# Altium schematic sheet Resistor - 316-379.SchDoc
size A0; SheetNumber: 8; SheetTotal: 41
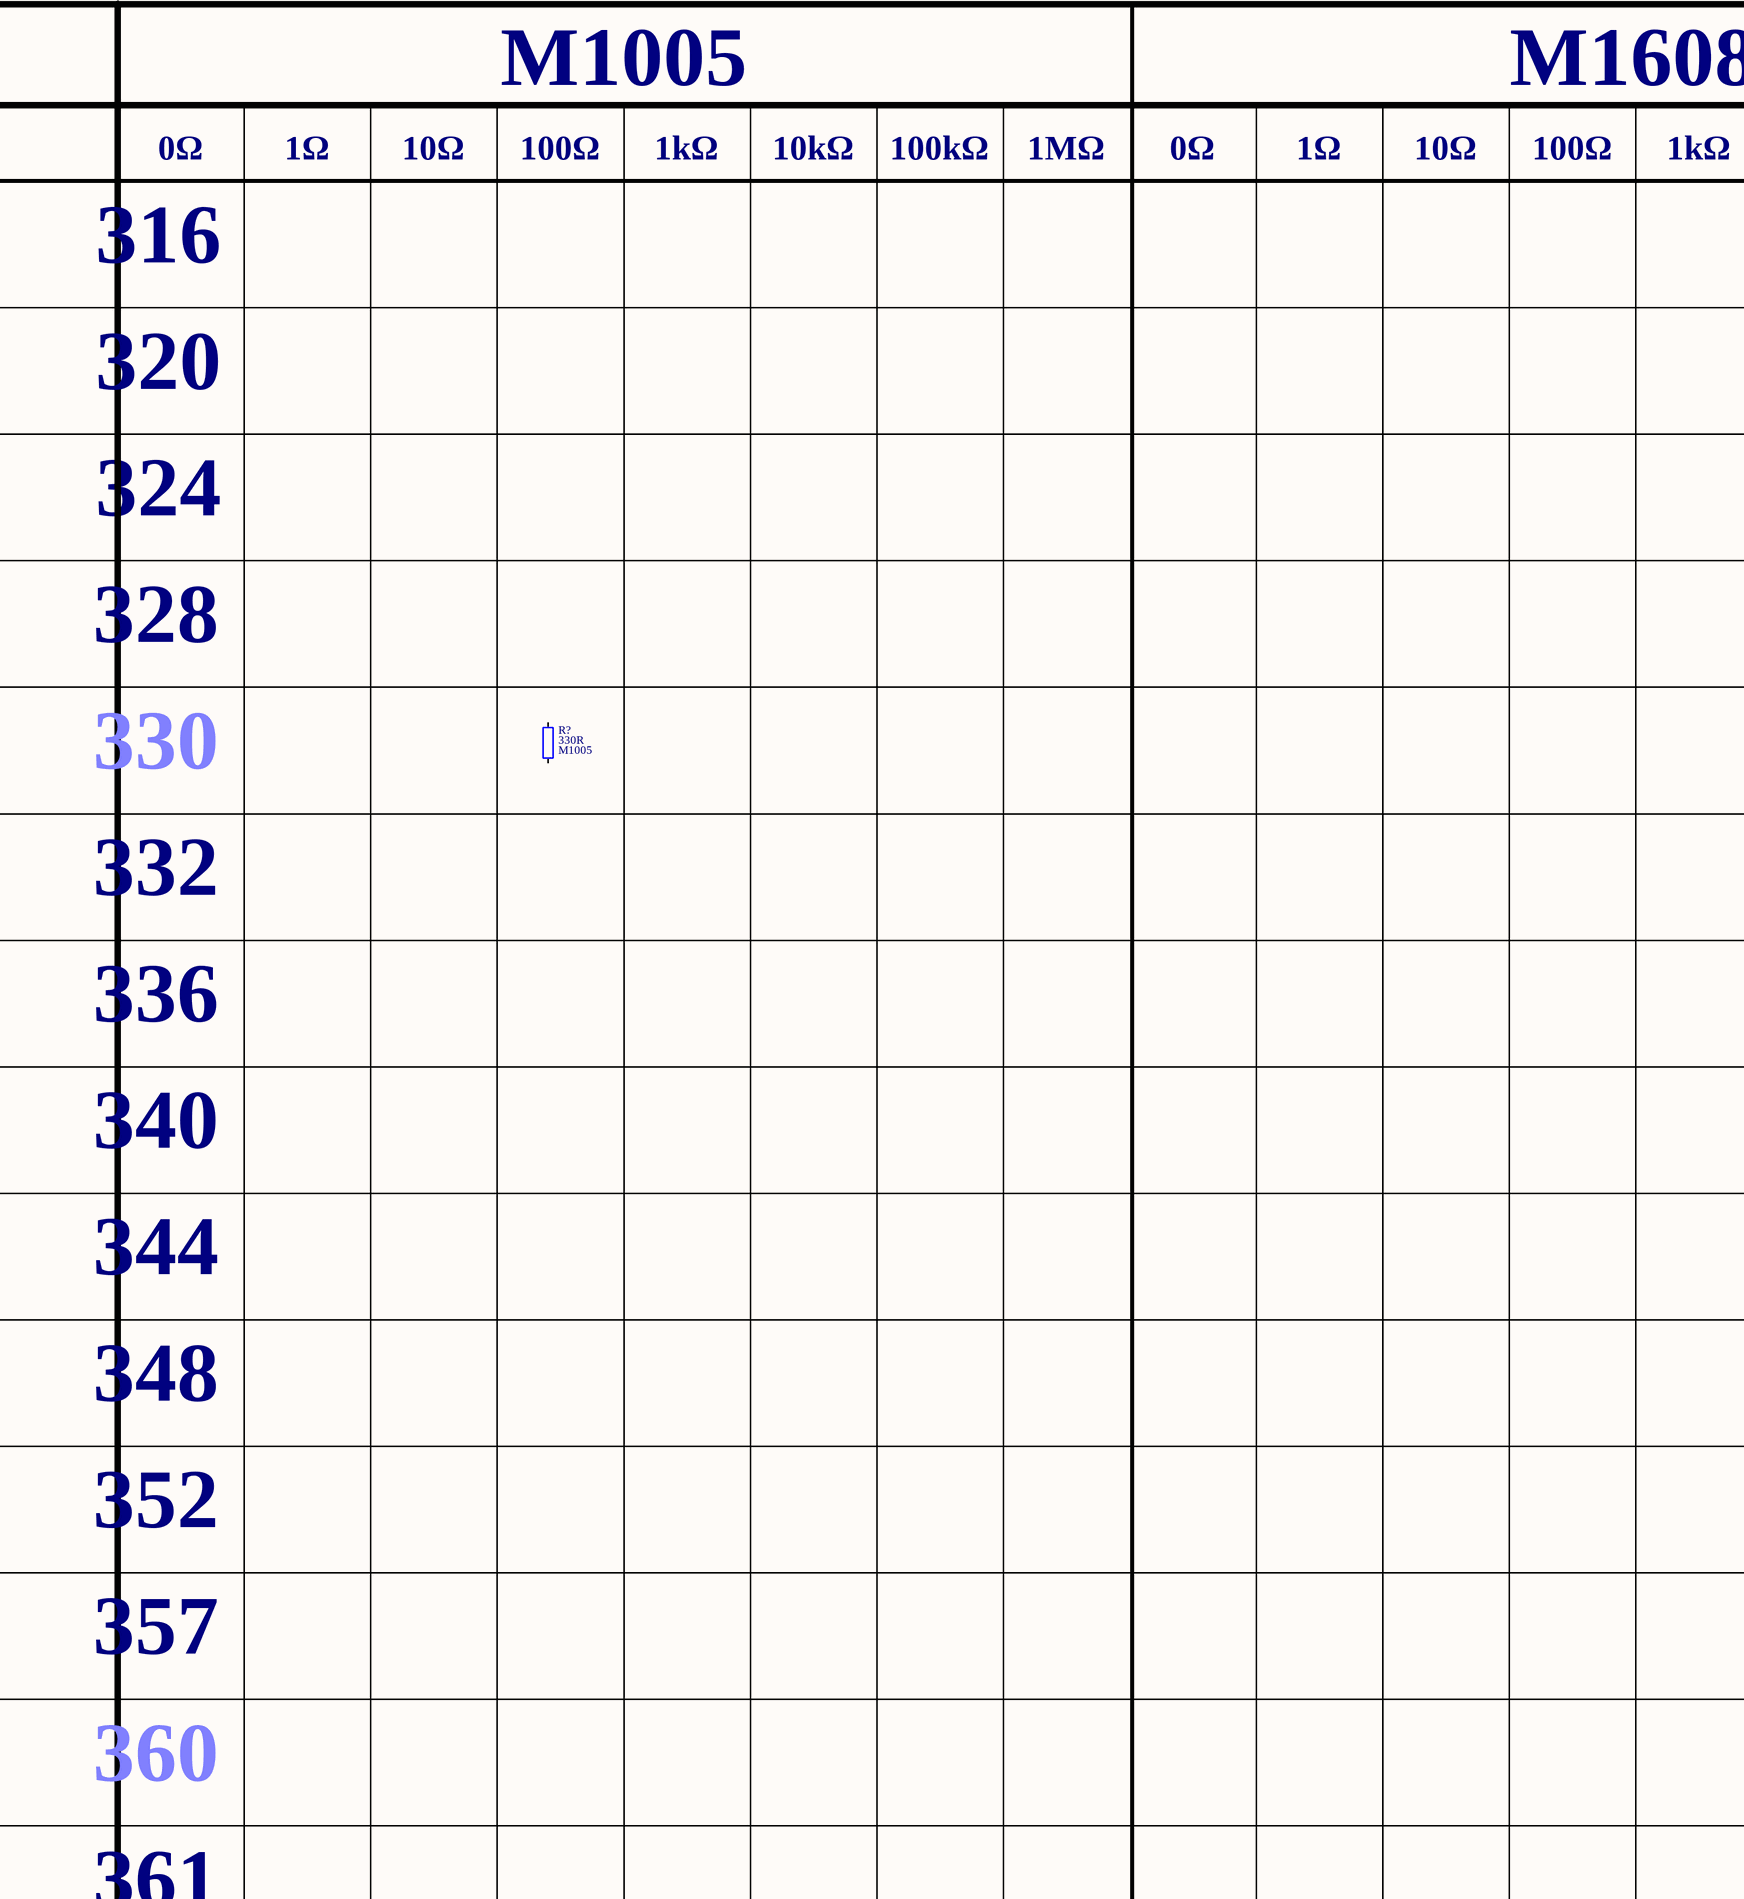
[diagram p0: Resistor - 316-379.SchDoc, top left]
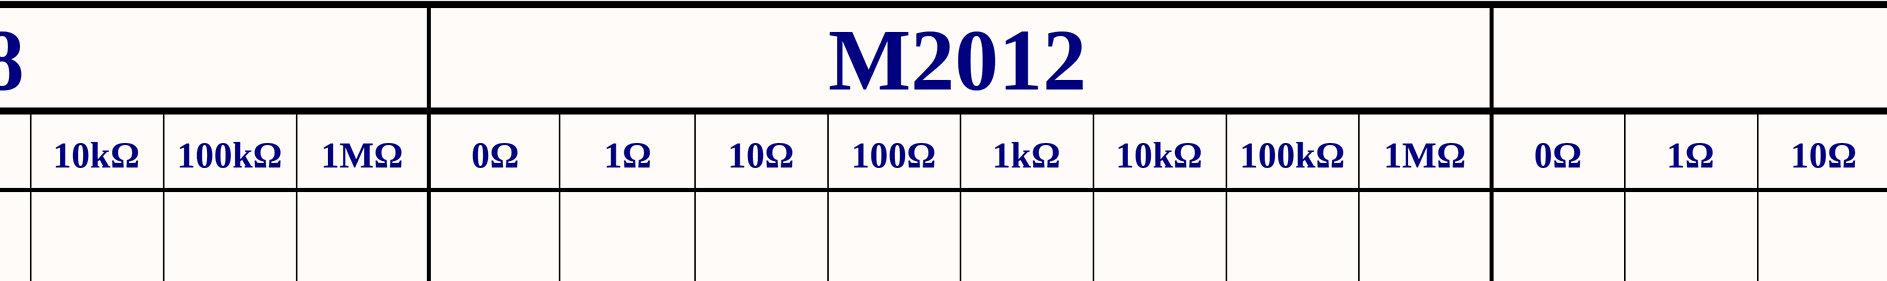
[diagram p1: Resistor - 316-379.SchDoc, top middle]
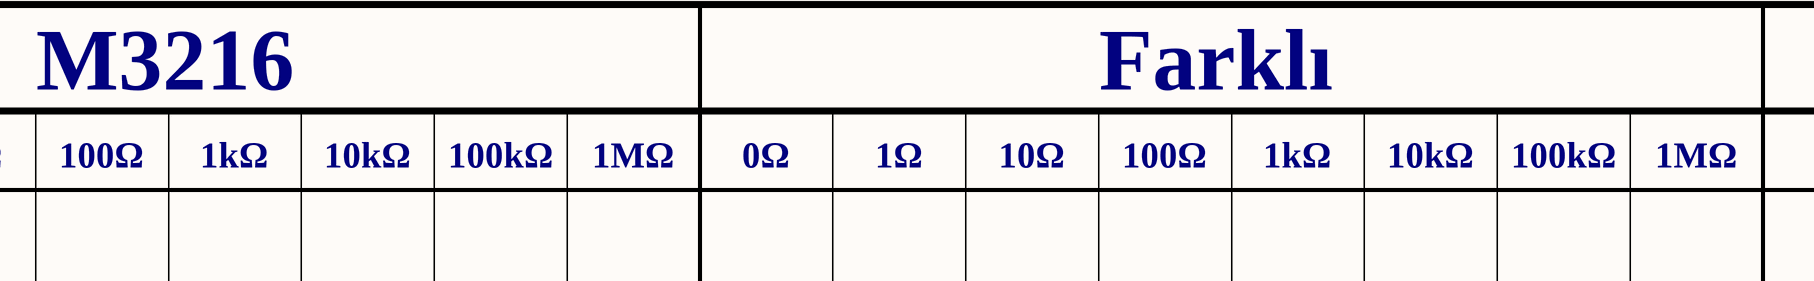
[diagram p2: Resistor - 316-379.SchDoc, top right]
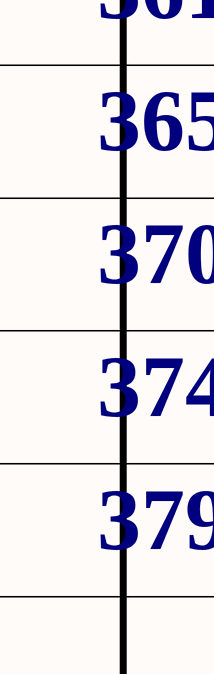
[diagram p3: Resistor - 316-379.SchDoc, bottom left]

## Parts
R?  value 330R  Package: M1005  [Resistor_Smd_M1005_I0402]  (hidden comment: Resistor)

## Nets

Not connected (* = marked no-connect by the designer): R? 1 2

## Notes on the sheet
- M1005
- M1608
- M2012
- M3216
- Farklı
- 0Ω
- 1Ω
- 10Ω
- 100Ω
- 1kΩ
- 10kΩ
- 100kΩ
- 1MΩ
- 316
- 320
- 324
- 328
- 330
- 332
- 336
- 340
- 344
- 348
- 352
- 357
- 360
- 361
- 365
- 370
- 374
- 379

## Library data of the parts
R? = Resistor: Res, 330R, 1%, M1005; Manufacturer: Yageo; Manufacturer Part Number: RC0402FR-07330RL; Component Category: Resistor; Component Type: Fixed Value; Tolerance: 1%; Supplier Link: https://www.digikey.com/en/products/detail/yageo/RC0402FR-07330RL/726594; Supplier Currency: $; Price, Max: 0.00129; Price, Min: 0.1; Quantity, Max: 100000; Quantity, Min: 1; Operating Temperature, Max: -55℃; Operating Temperature, Min: +155℃; Supplier Part Number: 311-330LRCT-ND; Supplier: Digikey; ComponentLink1Description: Datasheet; ComponentLink1URL: E:\Altium\Datasheets\Resistor\Yageo - RC_L Series.pdf; ComponentLink2Description: Supplier Link; ComponentLink2URL: https://www.digikey.com/en/products/detail/yageo/RC0402FR-07330RL/726594